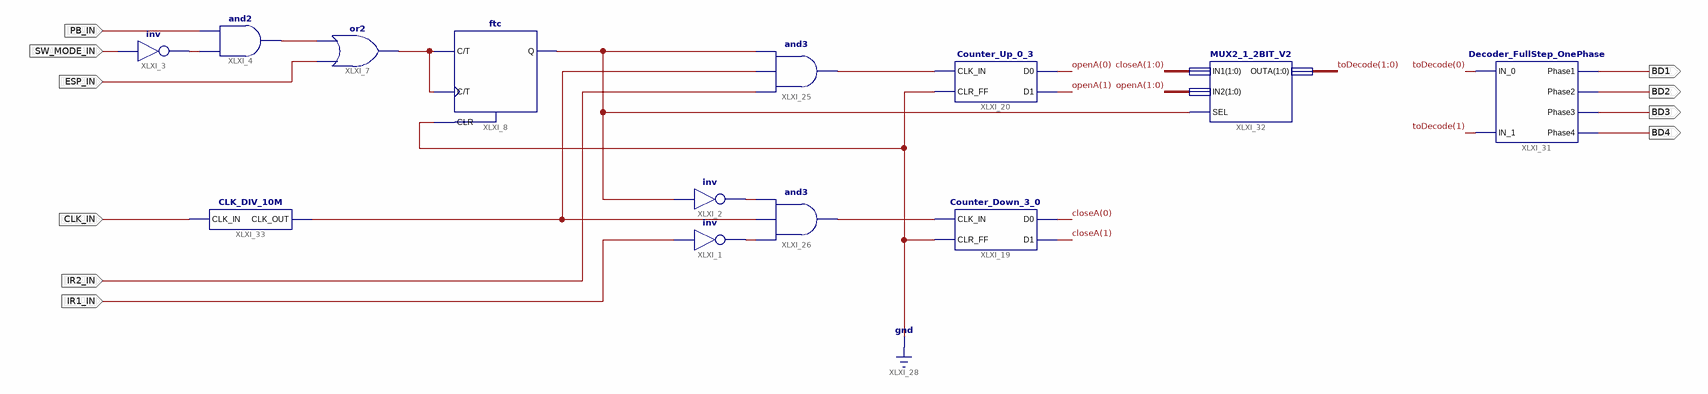
[diagram p0: schematic sheet 1]
// Xilinx ISE schematic GarrageDoor_V3.sch (spartan6) as structural Verilog: 13 symbols, 10 ports
module GarrageDoor_V3 (
  input  CLK_IN,
  input  IR1_IN,
  input  IR2_IN,
  input  ESP_IN,
  input  SW_MODE_IN,
  input  PB_IN,
  output BD4,
  output BD3,
  output BD2,
  output BD1
);

  wire XLXN_1, XLXN_6, XLXN_8, XLXN_16, XLXN_19, XLXN_21, XLXN_25, XLXN_26, XLXN_27;
  wire [1:0] closeA, openA, toDecode;

  Decoder_FullStep_OnePhase XLXI_31 (
    .IN_0(toDecode[0]), .IN_1(toDecode[1]), .Phase1(BD1), .Phase2(BD2), .Phase3(BD3), .Phase4(BD4));
  not XLXI_1 (XLXN_21, IR1_IN);
  not XLXI_2 (XLXN_25, XLXN_16);
  and XLXI_25 (XLXN_27, IR2_IN, XLXN_19, XLXN_16);
  and XLXI_26 (XLXN_26, XLXN_21, XLXN_19, XLXN_25);
  Counter_Up_0_3 XLXI_20 (.CLK_IN(XLXN_27), .CLR_FF(1'b0), .D0(openA[0]), .D1(openA[1]));
  Counter_Down_3_0 XLXI_19 (.CLK_IN(XLXN_26), .CLR_FF(1'b0), .D0(closeA[0]), .D1(closeA[1]));
  ftc XLXI_8 (.C(XLXN_8), .CLR(1'b0), .T(XLXN_8), .Q(XLXN_16));
  or XLXI_7 (XLXN_8, ESP_IN, XLXN_6);
  not XLXI_3 (XLXN_1, SW_MODE_IN);
  and XLXI_4 (XLXN_6, XLXN_1, PB_IN);
  MUX2_1_2BIT_V2 XLXI_32 (.IN1(closeA), .IN2(openA), .SEL(XLXN_16), .OUTA(toDecode));
  CLK_DIV_10M XLXI_33 (.CLK_IN(CLK_IN), .CLK_OUT(XLXN_19));
endmodule
